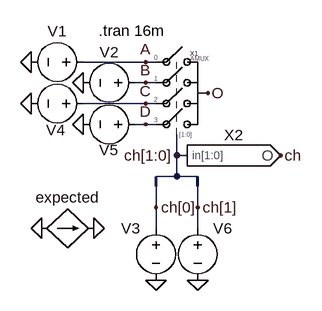
[diagram p0: schematic test-amux-4to1.asc]
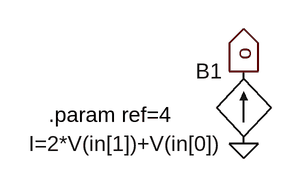
[diagram p1: sub-circuit dac-2bit-fast.asc]
test-amux-4to1.asc, the LTspice schematic file:
Version 4
SHEET 1 880 680
WIRE 48 144 -48 144
WIRE 64 144 48 144
WIRE 48 176 32 176
WIRE 64 176 48 176
WIRE 48 208 -48 208
WIRE 64 208 48 208
WIRE 48 240 32 240
WIRE 64 240 48 240
WIRE 96 288 96 256
WIRE 112 288 96 288
WIRE 96 320 96 288
WIRE 96 320 64 320
WIRE 128 320 96 320
WIRE 64 368 64 336
WIRE 128 368 128 336
WIRE 64 400 64 368
WIRE 128 400 128 368
FLAG -48 176 0
FLAG -128 144 0
FLAG 64 480 0
FLAG 144 192 O
FLAG 48 144 A
FLAG 48 176 B
FLAG 96 288 ch[1:0]
FLAG -32 400 0
FLAG -112 400 0
FLAG -48 240 0
FLAG -128 208 0
FLAG 48 208 C
FLAG 48 240 D
FLAG 128 480 0
FLAG 64 368 ch[0]
FLAG 128 368 ch[1]
FLAG 256 288 ch
BUSTAP 64 336 64 320
BUSTAP 128 336 128 320
SYMBOL voltage -32 144 R90
WINDOW 0 -32 56 VBottom 2
WINDOW 3 32 56 Invisible 2
WINDOW 123 0 0 Left 0
WINDOW 39 0 0 Left 0
SYMATTR InstName V1
SYMATTR Value SINE(0 1 1k)
SYMBOL voltage 48 176 R90
WINDOW 0 -32 56 VBottom 2
WINDOW 3 32 56 Invisible 2
WINDOW 123 0 0 Left 0
WINDOW 39 0 0 Left 0
SYMATTR InstName V2
SYMATTR Value SINE(0 0.5 10k)
SYMBOL voltage 64 384 M0
WINDOW 3 24 96 Invisible 2
WINDOW 123 0 0 Left 0
WINDOW 39 0 0 Left 0
SYMATTR Value PULSE(0 1 2m 1n 1n 2m 4m)
SYMATTR InstName V3
SYMBOL bi -112 400 R270
WINDOW 0 32 40 VTop 2
WINDOW 3 -32 40 Invisible 2
SYMATTR InstName expected
SYMATTR Value I=IF(V(ch)<0.5,V(A),IF(V(ch)<1.5,V(B),IF(V(ch)<2.5,V(C),V(D))))
SYMATTR Value2 Rpar=1
SYMBOL voltage -32 208 R90
WINDOW 0 56 58 VBottom 2
WINDOW 3 32 56 Invisible 2
WINDOW 123 0 0 Left 0
WINDOW 39 0 0 Left 0
SYMATTR InstName V4
SYMATTR Value SINE(0 0.2 500)
SYMBOL voltage 48 240 R90
WINDOW 0 55 57 VBottom 2
WINDOW 3 32 56 Invisible 2
WINDOW 123 0 0 Left 0
WINDOW 39 0 0 Left 0
SYMATTR InstName V5
SYMATTR Value SINE(0 2 3k)
SYMBOL voltage 128 384 R0
WINDOW 3 24 96 Invisible 2
WINDOW 123 0 0 Left 0
WINDOW 39 0 0 Left 0
SYMATTR Value PULSE(0 1 4m 1n 1n 4m 8m)
SYMATTR InstName V6
SYMBOL dac-2bit-fast 176 288 R0
SYMATTR InstName X2
SYMBOL amux-4to1 96 176 R0
SYMATTR InstName X1
TEXT -24 96 Left 2 !.tran 16m

dac-2bit-fast.asc, the sub-circuit schematic file:
Version 4
SHEET 1 880 680
FLAG 224 -48 o
IOPIN 224 -48 Out
FLAG 224 32 0
SYMBOL bi 224 32 R180
WINDOW 0 24 80 Left 2
WINDOW 3 24 0 Left 2
SYMATTR InstName B1
SYMATTR Value I=2*V(in[1])+V(in[0])
SYMATTR Value2 Rpar={ref/4}
TEXT 8 0 Left 2 !.param ref=4

The netlist it stands for:
* test-amux-4to1.asc
V1 A 0 SINE(0 1 1k)
V2 B 0 SINE(0 0.5 10k)
V3 ch[0] 0 PULSE(0 1 2m 1n 1n 2m 4m)
B§expected 0 0 I=IF(V(ch)<0.5,V(A),IF(V(ch)<1.5,V(B),IF(V(ch)<2.5,V(C),V(D)))) Rpar=1
V4 C 0 SINE(0 0.2 500)
V5 D 0 SINE(0 2 3k)
V6 ch[1] 0 PULSE(0 1 4m 1n 1n 4m 8m)
XX2 ch[1] ch[0] ch dac-2bit-fast
XX1 ch[1] ch[0] O A B C D amux-4to1  ; pins c[1:0] O X[0] X[1] X[2] X[3]

* block symbol definitions
.subckt dac-2bit-fast in[1] in[0] o
B1 0 o I=2*V(in[1])+V(in[0]) Rpar={ref/4}
.param ref=4
.ends dac-2bit-fast

.tran 16m
.backanno
.end